# EAGLE design Tri-color_LED_Breakout (EAGLE 6.3)
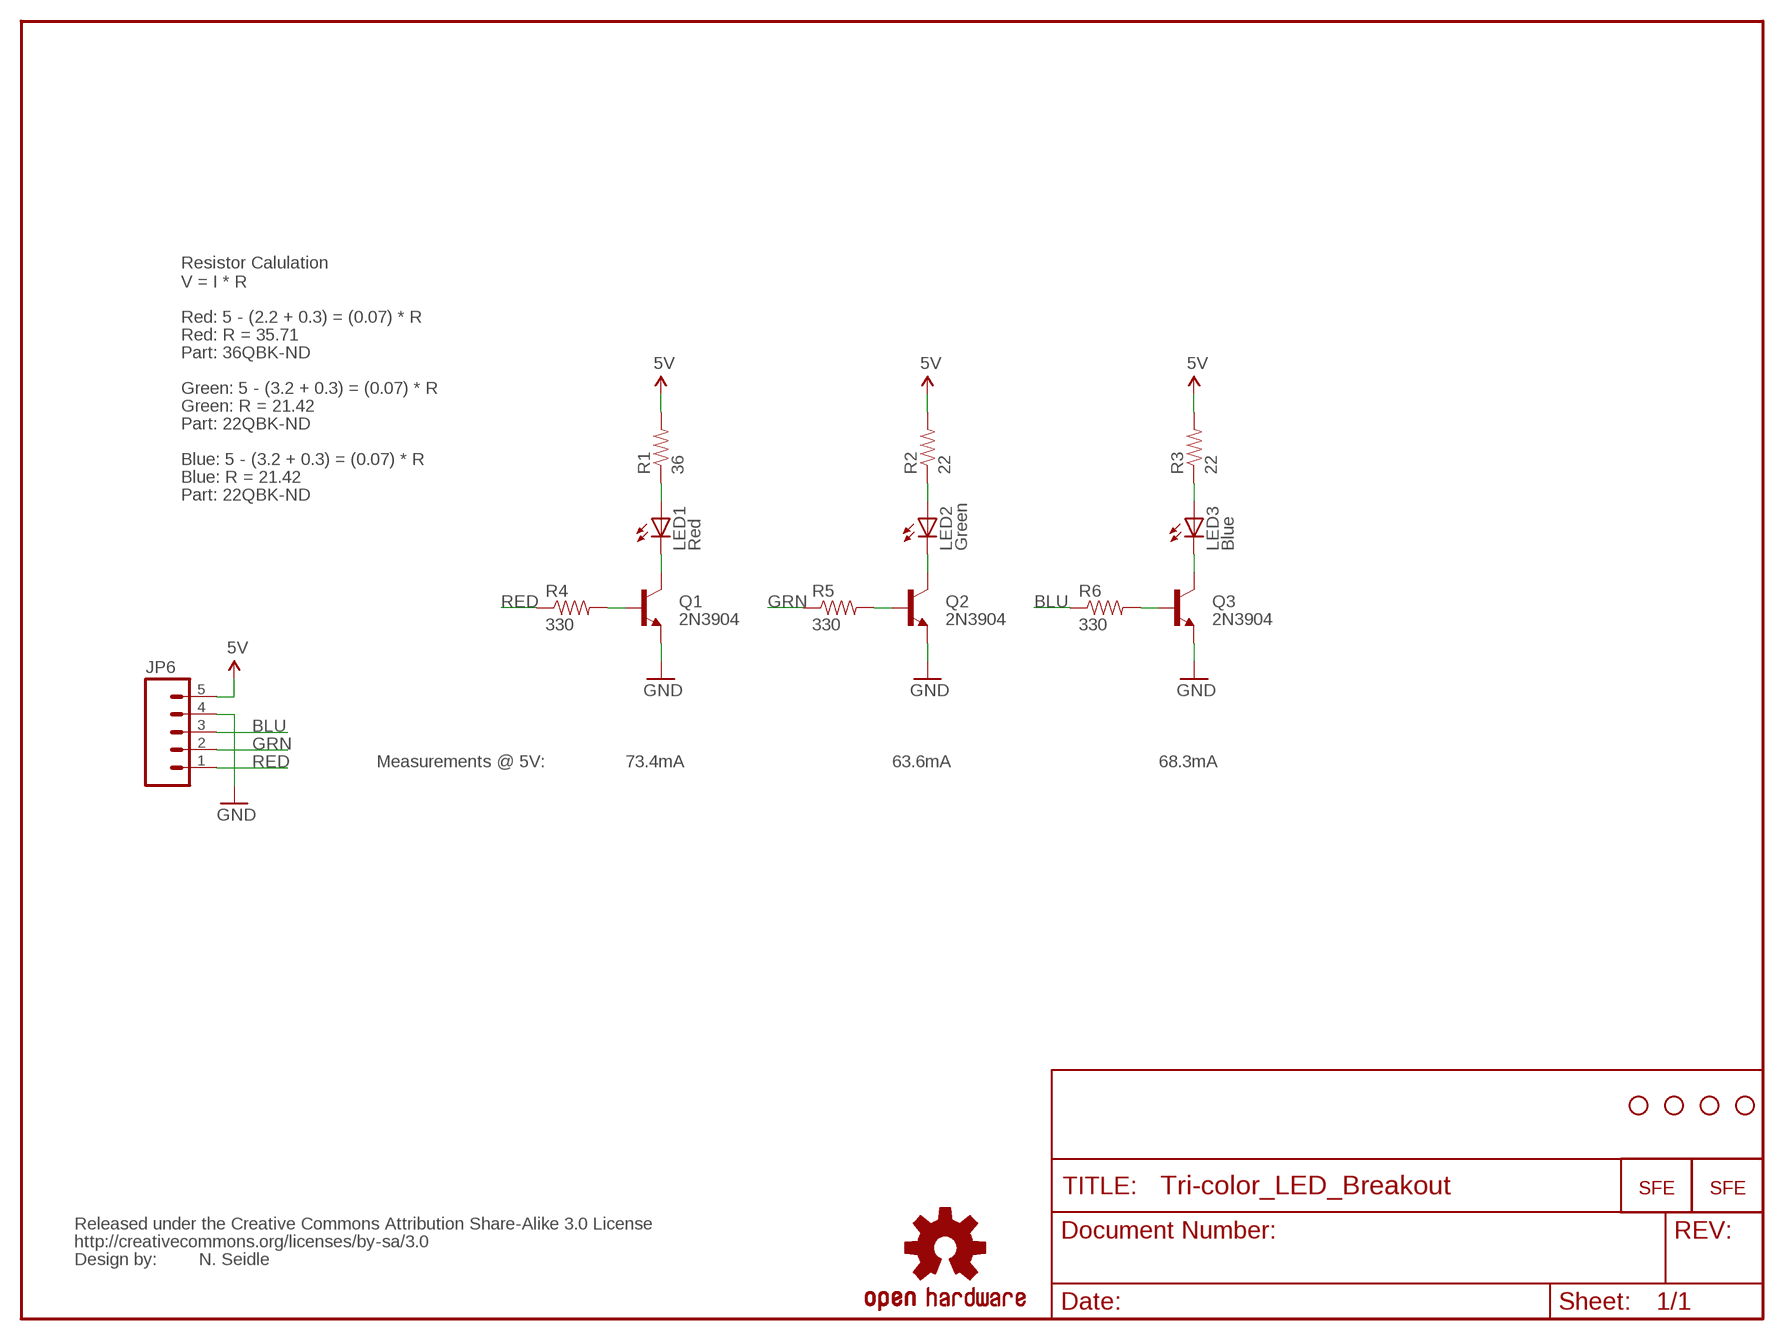
[diagram p0: schematic, sheet 1]

## Parts
JP1  STAND-OFF  [STAND-OFF]
JP2  STAND-OFF  [STAND-OFF]
JP3  STAND-OFF  [STAND-OFF]
JP4  STAND-OFF  [STAND-OFF]
JP5  LOGO-SFESK  [SFE-LOGO-FLAME]
JP6  M05PTH  [1X05]
JP7  LOGO-SFESK  [SFE-LOGO-FLAME]
LED1  Red  LED10MM  [LED10MM]
LED2  Green  LED10MM  [LED10MM]
LED3  Blue  LED10MM  [LED10MM]
Q1  2N3904  TRANSISTOR_NPNTO92  [TO-92]
Q2  2N3904  TRANSISTOR_NPNTO92  [TO-92]
Q3  2N3904  TRANSISTOR_NPNTO92  [TO-92]
R1  36  RESISTORPTH-1/4W  [AXIAL-0.4]
R2  22  RESISTORPTH-1/4W  [AXIAL-0.4]
R3  22  RESISTORPTH-1/4W  [AXIAL-0.4]
R4  330  RESISTORAXIAL-0.3  [AXIAL-0.3]
R5  330  RESISTORAXIAL-0.3  [AXIAL-0.3]
R6  330  RESISTORAXIAL-0.3  [AXIAL-0.3]
U$1  CREATIVE_COMMONS  [CREATIVE_COMMONS]
U$6  OSHW-LOGOS  [OSHW-LOGO-S]

## Nets
5V: JP6.5 R1.P$2 R2.P$2 R3.P$2
BLU: JP6.3 R6.P$1
GND: JP6.4 Q1.1(E) Q2.1(E) Q3.1(E)
GRN: JP6.2 R5.P$1
N$1: LED2.A R2.P$1
N$2: LED3.A R3.P$1
N$3: LED1.A R1.P$1
N$4: LED1.C Q1.3(C)
N$5: LED2.C Q2.3(C)
N$6: LED3.C Q3.3(C)
N$7: Q1.2(B) R4.P$2
N$8: Q2.2(B) R5.P$2
N$9: Q3.2(B) R6.P$2
RED: JP6.1 R4.P$1

## Notes on the sheet
- Resistor Calulation
  V = I * R
- Red: 5 - (2.2 + 0.3) = (0.07) * R
- Red: R = 35.71
- Part: 36QBK-ND
- Green: 5 - (3.2 + 0.3) = (0.07) * R
- Green: R = 21.42
- Part: 22QBK-ND
- Blue: 5 - (3.2 + 0.3) = (0.07) * R
- Blue: R = 21.42
- Part: 22QBK-ND
- Measurements @ 5V: | 73.4mA | 63.6mA | 68.3mA
- N. Seidle

## Library data of the parts
JP1-JP4 = SparkFun:STAND-OFF: Stand Off This is the mechanical footprint for a #4 phillips button head screw. Use the keepout ring to avoid running the screw head into surrounding components. SKU : PRT-00447
JP5 JP7 = SparkFun:LOGO-SFE: Spark Fun Electronics PCB Logo This is the standard Spark Fun Electronics PCB logo.
JP6 = SparkFun:M05: Header 5 Standard 5-pin 0.1" header. Use with straight break away headers (SKU : PRT-00116), right angle break away headers (PRT-00553), swiss pins (PRT-00743), machine pins (PRT-00117), and female headers (PRT-00115). Molex polarized connector foot print use with SKU : PRT-08230 with associated crimp pins and housings.
LED1-LED3 = SparkFun:LED: LEDs Standard schematic elements and footprints for 5mm, 3mm, 1206, and 0603 sized LEDs. 5mm - Spark Fun Electronics SKU : COM-00529 (and others)
Q1-Q3 = SparkFun:TRANSISTOR_NPN: Transistor NPN BJT configuration in SOT23 package. MMBT2222 is the common NPN we use. Double check BCE configuration again layout.
R1-R6 = SparkFun:RESISTOR: Resistor Basic schematic elements and footprints for 0603, 1206, and PTH resistors.
U$1 = SparkFun:CREATIVE_COMMONS
U$6 = SparkFun-Aesthetics:OSHW-LOGO: Open Source Hardware Logo This logo indicates the piece of hardware it is found on incorporates a OSHW license and/or adheres to the definition of open source hardware found here: http://freedomdefined.org/OSHW

## Board
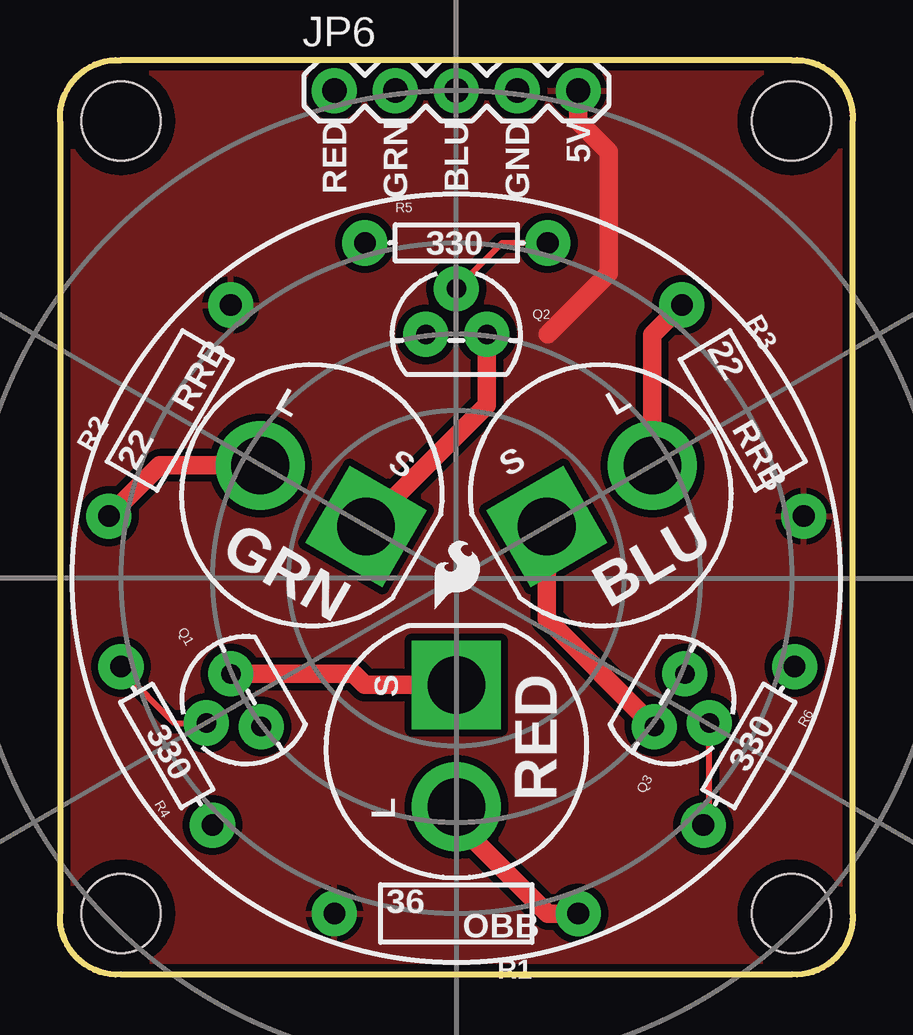
[diagram p1: board, top side]
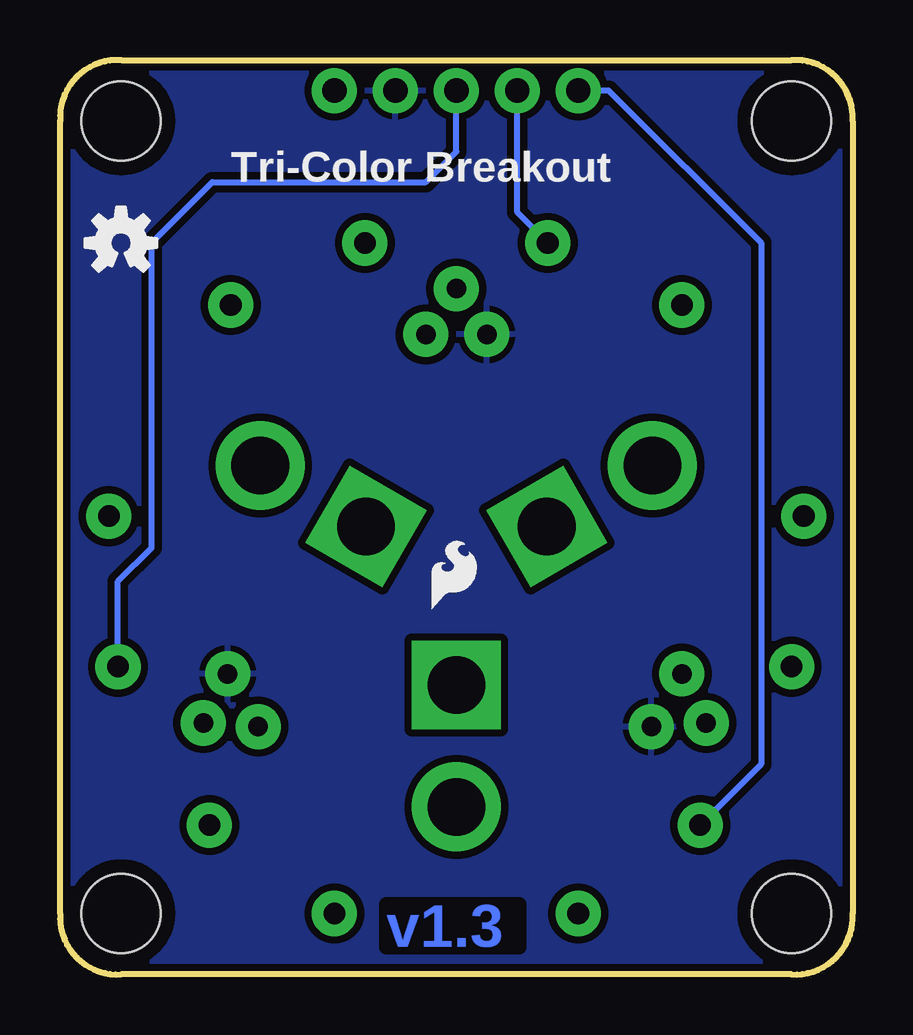
[diagram p2: board, bottom side, seen from below]

Size 33.03 x 38.11 mm. Coordinates in mm from the lower left corner, seen from the top.
Outline: 0,35.56 0,2.54 arc97 2.54,0 30.48,0 arc97 33.02,2.54 33.02,35.56 arc97 30.48,38.1 2.54,38.1 arc97 0,35.56
Copper layers (1*16): Top 0.0356mm / dielectric 1.5011mm / Bottom 0.0356mm
Design rules "default *": minimum track width 8mil, minimum drill 20mil, track to track 8mil, track to pad 8mil, pad to pad 8mil, via to via 8mil, smd to smd 8mil, copper to edge 10mil, drill to drill 8mil, minimum pad ring 12mil, minimum via ring 10mil, stop-mask expansion 4mil, vias tented up to drill 20mil, thermal gap 10mil

### Footprints (pad centres in the part's own frame; a part is rotated, then mirrored left to right if it is on the bottom)
STAND-OFF = hole 3.302: 0,0
1X05 = drill 1.016 pad 1.88: 1 0,0; 2 2.54,0; 3 5.08,0; 4 7.62,0; 5 10.16,0
LED10MM = drill 2.4 pad 3.7: A 2.54,0 | drill 2.4 pad 3.7 square: C -2.54,0
TO-92 = drill 0.813 pad 1.88: 1 -1.27,0; 2 0,1.905; 3 1.27,0
AXIAL-0.4 = drill 0.9 pad 1.88: P$1 -5.08,0; P$2 5.08,0
AXIAL-0.3 = drill 0.9 pad 1.88: P$1 -3.81,0; P$2 3.81,0

### Placement (x,y rotation side)
JP1  30.48,2.54 0 top
JP2  2.54,35.56 0 top
JP3  30.48,35.56 0 top
JP4  2.54,2.54 0 top
JP5  15.62,15.24 0 top
JP6  11.43,36.83 0 top
JP7  17.53,15.24 0 bottom
LED1  16.51,9.53 270 top
LED2  10.54,19.94 150 top
LED3  22.48,19.94 30 top
Q1  7.75,11.43 120 top
Q2  16.51,26.67 0 top
Q3  25.4,11.43 240 top
R1  16.51,2.54 180 top
R2  4.58,23.5 60 top
R3  28.45,23.5 300 top
R4  4.45,9.53 120 top
R5  16.51,30.48 0 top
R6  28.71,9.53 240 top
U$1  -15.24,-16.51 0 top  (outside the outline)
U$6  30.48,30.48 0 bottom

### Tracks (layer width: path | path; a pad name or v marks a point on that pad's centre or on a via)
5V
  Top 0.762: JP6.5 21.59,35.56 22.86,34.29 22.86,29.21 20.32,26.67
  pour Top (isolate 0.305): 0,38.1 33.02,38.1 33.02,0 0,0
BLU
  Bottom 0.254: R6.P$1 30.61,16.39 29.21,17.78 29.21,30.48 26.67,33.02 17.78,33.02 16.51,34.29 JP6.3
GND
  pour Bottom (isolate 0.305): 0,38.1 33.02,38.1 33.02,0 0,0
GRN
  Bottom 0.254: R5.P$1 13.97,31.75 JP6.2
N$1
  Top 0.762: LED2.A 4.15,21.21 R2.P$1
N$2
  Top 0.762: LED3.A 24.68,26.67 R3.P$1
N$3
  Top 0.762: LED1.A 16.51,6.35 20.32,2.54 R1.P$1
N$4
  Top 0.762: Q1.3 12.24,12.53 12.7,12.07 LED1.C
N$5
  Top 0.762: Q2.3 17.78,23.71 LED2.C
N$6
  Top 0.762: LED3.C 20.28,14.82 Q3.3
N$7
  Top 0.254: Q1.2 4.77,10.48 2.54,12.7 R4.P$2
N$8
  Top 0.254: R5.P$2 18.42,30.48 Q2.2
N$9
  Top 0.254: R6.P$2 27.05,6.48 Q3.2
RED
  Bottom 0.254: JP6.1 10.16,36.83 3.81,30.48 3.81,8.77 R4.P$1

### Text on the board
Bottom: v1.3
tPlace: RED | GRN | BLU | GND | 5V | RRB | L | L | RRB | S | S | GRN | BLU | S | RED | L | OBB | N. Seidle
bPlace: Tri-Color Breakout